# EAGLE design RTI-Dome-eth (EAGLE 7.7.0)

## Sheet 1 of 2
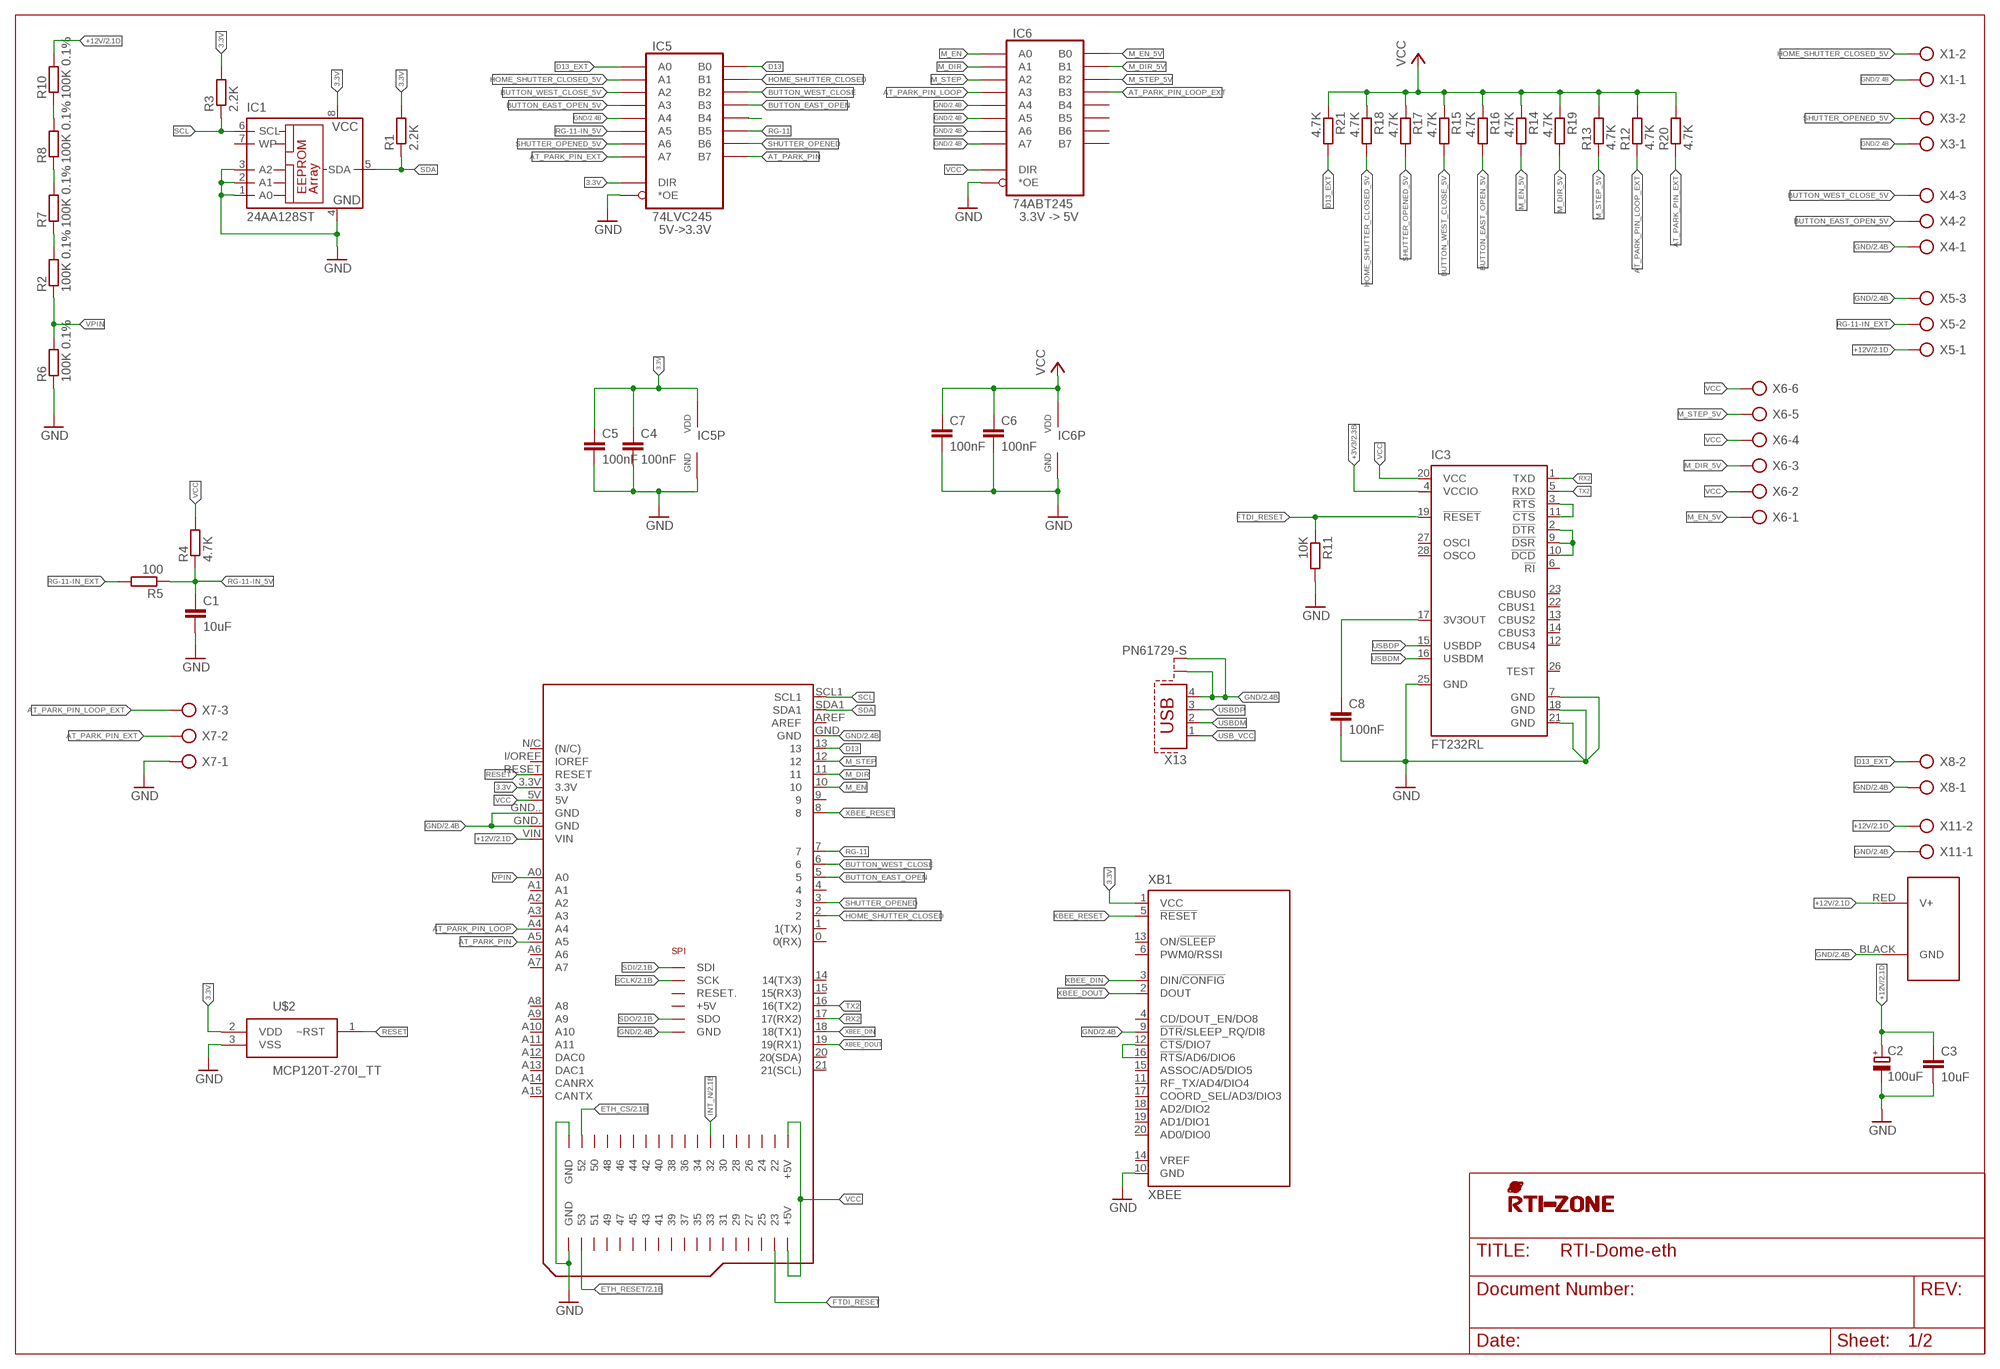
[diagram p0: schematic, sheet 1]

### Parts
C1  10uF  C-EU'0805'  [C0805]
C2  100uF  CPOL-EU  [UD-10X10_NICHICON]
C3  10uF  C-EU'0805'  [C0805]
C4  100nF  C-EU'0805'  [C0805]
C5  100nF  C-EU'0805'  [C0805]
C6  100nF  C-EU'0805'  [C0805]
C7  100nF  C-EU'0805'  [C0805]
C8  100nF  C-EU'0805'  [C0805]
IC1  24AA128ST  [TSSOP8]
IC3  FT232RL  [SSOP28]
IC5  74LVC245  [TSSOP20]
IC6  74ABT245  [TSSOP20]
J1  POWERPOLE_POWER45A  [POWERPOLE_PAIR_45A]
R1  2.2K  R-EU'0805'  [R0805]
R2  100K 0.1%  R-EU'0805'  [R0805]
R3  2.2K  R-EU'0805'  [R0805]
R4  4.7K  R-EU'0805'  [R0805]
R5  100  R-EU'0805'  [R0805]
R6  100K 0.1%  R-EU'0805'  [R0805]
R7  100K 0.1%  R-EU'0805'  [R0805]
R8  100K 0.1%  R-EU'0805'  [R0805]
R10  100K 0.1%  R-EU'0805'  [R0805]
R11  10K  R-EU'0805'  [R0805]
R12  4.7K  R-EU'0805'  [R0805]
R13  4.7K  R-EU'0805'  [R0805]
R14  4.7K  R-EU'0805'  [R0805]
R15  4.7K  R-EU'0805'  [R0805]
R16  4.7K  R-EU'0805'  [R0805]
R17  4.7K  R-EU'0805'  [R0805]
R18  4.7K  R-EU'0805'  [R0805]
R19  4.7K  R-EU'0805'  [R0805]
R20  4.7K  R-EU'0805'  [R0805]
R21  4.7K  R-EU'0805'  [R0805]
U$1  ARDUINO_DUE_SHIELD_FULL  [ARDUINO_DUE_SHIELD_FULL]
U$2  MCP120T-270I_TT  [SOT95P237X112-3N]
U$4  RTI-LOGO_BIG  [LOGO_BIG]
X1  AK500/2  [AK500/2]
X3  AK500/2  [AK500/2]
X4  AK500/3  [AK500/3]
X5  AK500/3  [AK500/3]
X6  AK500/6  [AK500/6]
X7  AK500/3  [AK500/3]
X8  AK500/2  [AK500/2]
X11  AK500/2  [AK500/2]
X13  PN61729-S  [PN61729-S]
XB1  XBEE  [XBEE]

### Nets
3.3V: C4.1 C5.1 IC1.8(VCC) IC5.P$1(DIR) IC5.P$20(VDD) R1.2 R3.2 U$1.3.3V U$2.2(VDD) XB1.1(VCC)
+3V3 [+3V3]: IC3.4(VCCIO) ; also sheet 2
+12V [+12V]: C2.+ C3.1 J1.RED(V+) R10.2 U$1.VIN X5.1 X11.2 ; also sheet 2
AT_PARK_PIN: IC5.P$11(B7) U$1.A5
AT_PARK_PIN_EXT: IC5.P$9(A7) R20.1 X7.2
AT_PARK_PIN_LOOP: IC6.P$5(A3) U$1.A4
AT_PARK_PIN_LOOP_EXT: IC6.P$15(B3) R12.1 X7.3
BUTTON_EAST_OPEN: IC5.P$15(B3) U$1.5
BUTTON_EAST_OPEN_5V: IC5.P$5(A3) R16.2 X4.2
BUTTON_WEST_CLOSE: IC5.P$16(B2) U$1.6
BUTTON_WEST_CLOSE_5V: IC5.P$4(A2) R15.2 X4.3
D13: IC5.P$18(B0) U$1.13
D13_EXT: IC5.P$2(A0) R21.2 X8.2
DTR_DSR_DCD: IC3.2(!DTR) IC3.9(!DSR) IC3.10(!DCD)
ETH_CS: U$1.52 ; also sheet 2
ETH_RESET: U$1.53 ; also sheet 2
FTDI_RESET: IC3.19(!RESET) R11.1 U$1.23
GND [GND]: C1.2 C2.- C3.2 C4.2 C5.2 C6.2 C7.2 C8.2 IC1.1(A0) IC1.2(A1) IC1.3(A2) IC1.4(GND) IC3.7(GND) IC3.18(GND) IC3.21(GND) IC3.25(GND) IC5.P$6(A4) IC5.P$10(GND) IC5.P$19(*OE) IC6.P$6(A4) IC6.P$7(A5) IC6.P$8(A6) IC6.P$9(A7) IC6.P$10(GND) IC6.P$19(*OE) J1.BLACK(GND) R6.1 R11.2 U$1.GND U$1.GND.(GND) U$1.GND..(GND) U$1.GND...(GND) U$1.GND....(GND) U$1.GND__(GND) U$2.3(VSS) X1.1 X3.1 X4.1 X5.3 X7.1 X8.1 X11.1 X13.4 X13.S1 X13.S2 XB1.9(!DTR!/SLEEP_RQ/DI8) XB1.10(GND) ; also sheet 2
HOME_SHUTTER_CLOSED: IC5.P$17(B1) U$1.2
HOME_SHUTTER_CLOSED_5V: IC5.P$3(A1) R18.2 X1.2
INT_N: U$1.32 ; also sheet 2
M_DIR: IC6.P$3(A1) U$1.11
M_DIR_5V: IC6.P$17(B1) R19.2 X6.3
M_EN: IC6.P$2(A0) U$1.10
M_EN_5V: IC6.P$18(B0) R14.2 X6.1
M_STEP: IC6.P$4(A2) U$1.12
M_STEP_5V: IC6.P$16(B2) R13.1 X6.5
N$2: R7.2 R8.1
N$3: R8.2 R10.1
N$4: IC5.P$14(B4)
N$5: R2.2 R7.1
N$6: C8.1 IC3.17(3V3OUT)
N$9: XB1.12(!CTS!/DIO7) XB1.16(!RTS!/AD6/DIO6)
RESET: U$1.RESET U$2.1(~RST)
RG-11: IC5.P$13(B5) U$1.7
RG-11-IN_5V: C1.1 IC5.P$7(A5) R4.1 R5.1
RG-11-IN_EXT: R5.2 X5.2
RTS_CTS: IC3.3(!RTS) IC3.11(!CTS)
RX2: IC3.1(TXD) U$1.17(17(RX2))
SCL: IC1.6(SCL) R3.1 U$1.SCL1
SCLK: U$1.SCK ; also sheet 2
SDA: IC1.5(SDA) R1.1 U$1.SDA1
SDI: U$1.MISO(SDI) ; also sheet 2
SDO: U$1.MOSI(SDO) ; also sheet 2
SHUTTER_OPENED: IC5.P$12(B6) U$1.3
SHUTTER_OPENED_5V: IC5.P$8(A6) R17.2 X3.2
TX2: IC3.5(RXD) U$1.16(16(TX2))
USB_VCC: X13.1
USBDM: IC3.16(USBDM) X13.2
USBDP: IC3.15(USBDP) X13.3
VCC: C6.1 C7.1 IC3.20(VCC) IC6.P$1(DIR) IC6.P$20(VDD) R4.2 R12.2 R13.2 R14.1 R15.1 R16.1 R17.1 R18.1 R19.1 R20.2 R21.1 U$1.5V U$1.5V.(+5V) U$1.5V..(+5V) X6.2 X6.4 X6.6
VPIN: R2.1 R6.2 U$1.A0
XBEE_DIN: U$1.18(18(TX1)) XB1.3(DIN/!CONFIG)
XBEE_DOUT: U$1.19(19(RX1)) XB1.2(DOUT)
XBEE_RESET: U$1.8 XB1.5(!RESET)
Unconnected: IC1.7(WP) IC3.6(!RI) IC3.12(CBUS4) IC3.13(CBUS2) IC3.14(CBUS3) IC3.22(CBUS1) IC3.23(CBUS0) IC3.26(TEST) IC3.27(OSCI) IC3.28(OSCO) IC6.P$11(B7) IC6.P$12(B6) IC6.P$13(B5) IC6.P$14(B4) U$1.0(0(RX)) U$1.1(1(TX)) U$1.4 U$1.9 U$1.14(14(TX3)) U$1.15(15(RX3)) U$1.20(20(SDA)) U$1.21(21(SCL)) U$1.22 U$1.24 U$1.25 U$1.26 U$1.27 U$1.28 U$1.29 U$1.30 U$1.31 U$1.33 U$1.34 U$1.35 U$1.36 U$1.37 U$1.38 U$1.39 U$1.40 U$1.41 U$1.42 U$1.43 U$1.44 U$1.45 U$1.46 U$1.47 U$1.48 U$1.49 U$1.50 U$1.51 U$1.A1 U$1.A2 U$1.A3 U$1.A6 U$1.A7 U$1.A8 U$1.A9 U$1.A10 U$1.A11 U$1.A12(DAC0) U$1.A13(DAC1) U$1.A14(CANRX) U$1.A15(CANTX) U$1.AREF U$1.I/OREF(IOREF) U$1.N/C((N/C)) U$1.RESET. XB1.4(CD/DOUT_EN/DO8) XB1.6(PWM0/RSSI) XB1.11(RF_TX/AD4/DIO4) XB1.13(ON/!SLEEP) XB1.14(VREF) XB1.15(ASSOC/AD5/DIO5) XB1.17(COORD_SEL/AD3/DIO3) XB1.18(AD2/DIO2) XB1.19(AD1/DIO1) XB1.20(AD0/DIO0)

### Notes on the sheet
- 3.3V -> 5V
- 5V->3.3V

## Sheet 2 of 2
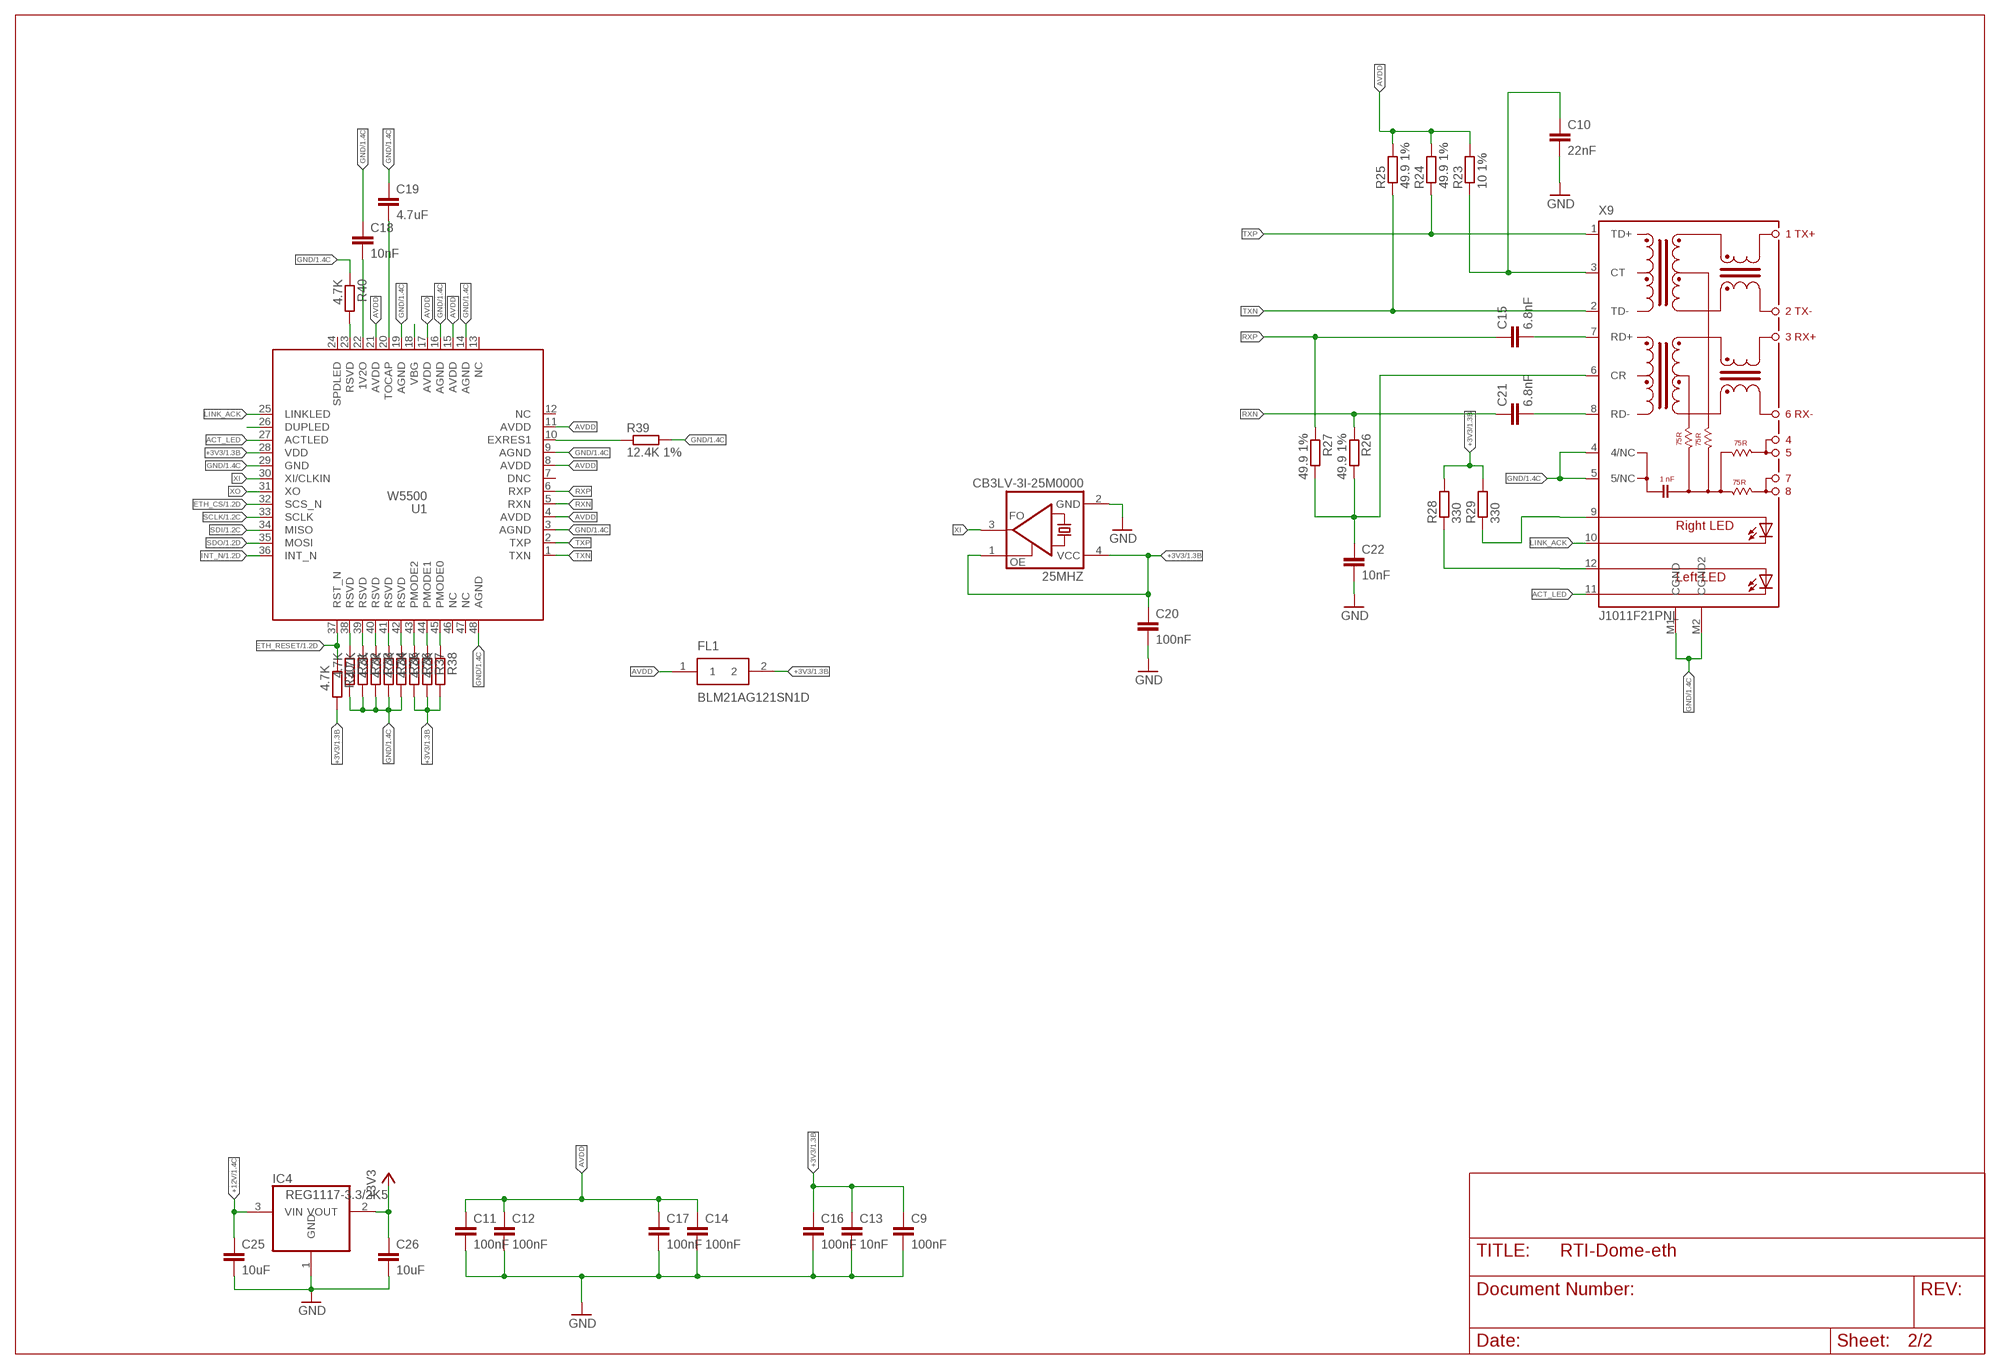
[diagram p1: schematic, sheet 2]

### Parts
25MHZ  CB3LV-3I-25M0000  CB3LV-OSCILATOR  [SMD-7050_4P]
C9  100nF  C-EU'0805'  [C0805]
C10  22nF  C-EU'0805'  [C0805]
C11  100nF  C-EU'0805'  [C0805]
C12  100nF  C-EU'0805'  [C0805]
C13  10nF  C-EU'0805'  [C0805]
C14  100nF  C-EU'0805'  [C0805]
C15  6.8nF  C-EU'0805'  [C0805]
C16  100nF  C-EU'0805'  [C0805]
C17  100nF  C-EU'0805'  [C0805]
C18  10nF  C-EU'0805'  [C0805]
C19  4.7uF  C-EU'0805'  [C0805]
C20  100nF  C-EU'0805'  [C0805]
C21  6.8nF  C-EU'0805'  [C0805]
C22  10nF  C-EU'0805'  [C0805]
C25  10uF  C-EU'0805'  [C0805]
C26  10uF  C-EU'0805'  [C0805]
FL1  BLM21AG121SN1D  [L0805]
IC4  REG1117-3.3/2K5  REG1117  [SOT223]
R23  10 1%  R-EU'0805'  [R0805]
R24  49.9 1%  R-EU'0805'  [R0805]
R25  49.9 1%  R-EU'0805'  [R0805]
R26  49.9 1%  R-EU'0805'  [R0805]
R27  49.9 1%  R-EU'0805'  [R0805]
R28  330  R-EU'0805'  [R0805]
R29  330  R-EU'0805'  [R0805]
R30  4.7K  R-EU'0805'  [R0805]
R31  4.7K  R-EU'0805'  [R0805]
R32  4.7K  R-EU'0805'  [R0805]
R33  4.7K  R-EU'0805'  [R0805]
R34  4.7K  R-EU'0805'  [R0805]
R35  4.7K  R-EU'0805'  [R0805]
R36  4.7K  R-EU'0805'  [R0805]
R37  4.7K  R-EU'0805'  [R0805]
R38  4.7K  R-EU'0805'  [R0805]
R39  12.4K 1%  R-EU'0805'  [R0805]
R40  4.7K  R-EU'0805'  [R0805]
U1  W5500  [LQFP48]
X9  J1011F21PNL  [J1011F21PNL]

### Nets
+3V3 [+3V3]: 25MHZ.1(OE) 25MHZ.4(VDD) C9.1 C13.1 C16.1 C20.1 C26.1 FL1.2 IC4.2(VOUT) R28.2 R29.2 R30.2 R36.2 R37.2 R38.2 U1.28(VDD) ; also sheet 1
+12V [+12V]: C25.1 IC4.3(VIN) ; also sheet 1
ACT_LED: U1.27(ACTLED) X9.11(C-L)
AVDD: C11.1 C12.1 C14.1 C17.1 FL1.1 R23.2 R24.2 R25.2 U1.4(AVDD) U1.8(AVDD) U1.11(AVDD) U1.15(AVDD) U1.17(AVDD) U1.21(AVDD)
ETH_CS: U1.32(SCS_N) ; also sheet 1
ETH_RESET: R30.1 U1.37(RST_N) ; also sheet 1
GND [GND]: 25MHZ.2(GND) C9.2 C10.2 C11.2 C12.2 C13.2 C14.2 C16.2 C17.2 C18.1 C19.1 C20.2 C22.2 C25.2 C26.2 IC4.1(GND) R31.2 R32.2 R33.2 R34.2 R35.2 R39.2 R40.1 U1.3(AGND) U1.9(AGND) U1.14(AGND) U1.16(AGND) U1.19(AGND) U1.29(GND) U1.48(AGND) X9.4(4/NC) X9.5(5/NC) X9.M1(CGND) X9.M2(CGND2) ; also sheet 1
INT_N: U1.36(INT_N) ; also sheet 1
LINK_ACK: U1.25(LINKLED) X9.10(C-R)
N$7 [+3V3]: C22.1 R26.2 R27.2 X9.6(CR)
N$8: R29.1 X9.9(A-R)
N$10: R28.1 X9.12(AL)
N$11: C15.2 X9.7(RD+)
N$12: C21.2 X9.8(RD-)
N$13 [+3V3]: C10.1 R23.1 X9.3(CT)
N$17: U1.26(DUPLED)
N$22: R31.1 U1.38(RSVD)
N$23: R32.1 U1.39(RSVD)
N$24: R33.1 U1.40(RSVD)
N$25: R34.1 U1.41(RSVD)
N$26: R35.1 U1.42(RSVD)
N$27: R36.1 U1.43(PMODE2)
N$28: R37.1 U1.44(PMODE1)
N$29: R38.1 U1.45(PMODE0)
N$31: C19.2 U1.20(TOCAP)
N$32: U1.18(VBG)
N$33: C18.2 U1.22(1V2O)
N$34: R39.1 U1.10(EXRES1)
N$35: R40.2 U1.23(RSVD)
RXN: C21.1 R26.1 U1.5(RXN)
RXP: C15.1 R27.1 U1.6(RXP)
SCLK: U1.33(SCLK) ; also sheet 1
SDI: U1.34(MISO) ; also sheet 1
SDO: U1.35(MOSI) ; also sheet 1
TXN [diff]: R25.1 U1.1(TXN) X9.2(TD-)
TXP: R24.1 U1.2(TXP) X9.1(TD+)
XI: 25MHZ.3(FO) U1.30(XI/CLKIN)
XO: U1.31(XO)
Unconnected: U1.7(DNC) U1.12(NC) U1.13(NC) U1.24(SPDLED) U1.46(NC) U1.47(NC)

## Power pins joined to a net without a drawn wire
+5V: U$1.+5V_(+5V)

## Library data of the parts
25MHZ = rti:CB3LV-OSCILATOR; MPN: CB3LV-3I-25M0000
C1 C3 C25 C26 = rti:C-EU; MPN: CC0805KKX5R8BB106
C2 = rti:CPOL-EU; MPN: MAL215099804E3
C4-C9 C11 C12 C14 C16 C17 C20 = rti:C-EU; MPN: 0805YD104KAT2A
C10 = rti:C-EU; MPN: CC0805JRX7R8BB223
C13 C18 C22 = rti:C-EU; MPN: CC0805KRX7R9BB103
C15 C21 = rti:C-EU; MPN: C0805C682F4HACTU
C19 = rti:C-EU; MPN: C0805C475J3RACTU
FL1 = BLM21AG121SN1D:BLM21AG121SN1D: BLM21_N1D Series EMI Suppression Filter 120+/-25% at 100MHz 1A @85 Source: Datasheet <https://www.murata.com/en-us/products/productdetail?partno=BLM21AG121SN1#>; MPN: BLM21AG121SN1D
IC1 = microchip:24*: Serial EEPROM I2C; MF: MICROCHIP; MPN: 24AA128-I/ST; OC_FARNELL: unknown; OC_NEWARK: 92C6843
IC3 = ftdichip:FT232R: Source: http://www.ftdichip.com/Documents/DataSheets/DS_FT232R_v104.pdf; MPN: FT232RL-REEL; OC_FARNELL: 1146032; OC_NEWARK: 91K9918
IC4 = burr-brown:REG1117: 800mA and 1A Low Dropout (LDO) Positive Regulator 1.8V, 2.5V, 2.85V, 3.3V, 5V, and Adj; MPN: REG1117-3.3/2K5; OC_FARNELL: 1097566; OC_NEWARK: 14P6981
IC5 = rti:74*245; MPN: 74LVC245APW,112
IC6 = rti:74*245; MPN: 74ABT245PW,112
J1 = powerpoles:POWERPOLE_POWER: Anderson Powerpole Power Connector using ameteur radio standard layout
R1 R3 = rti:R-EU; MPN: RT0805FRE071KL
R2 R6-R8 R10 = rti:R-EU; MPN: AT0805BRD07100KL
R4 R12-R21 R30-R38 R40 = rti:R-EU; MPN: RT0805FRE074K7L
R5 = rti:R-EU; MPN: RT0805FRD07100RL
R11 = rti:R-EU; MPN: RT0805FRE0710KL
R23 = rti:R-EU; MPN: RT0805FRE1310RL
R24-R27 = rti:R-EU; MPN: RC0805FR-0749R9L
R28 R29 = rti:R-EU; MPN: RC0805JR-07330RL
R39 = rti:R-EU; MPN: RC0805FR-0712K4L
U1 = W5500:W5500; MPN: W5500
U$1 = arduino_shield:ARDUINO_DUE_SHIELD_FULL
U$2 = MCP120T-270I_TT:MCP120T-270I_TT: Microcontroller Supervisory Circuit Source: Datasheet; DESCRIPTION: Microcontroller Supervisory Circuit; HEIGHT: mm; MANUFACTURER_NAME: Microchip; MANUFACTURER_PART_NUMBER: MCP120T-270I/TT; MOUSER_PART_NUMBER: 579-MCP120T-270I/TT; MOUSER_PRICE-STOCK: https://www.mouser.co.uk/ProductDetail/Microchip-Technology/MCP120T-270I-TT?qs=JaP0%252BruNJH91Pwyk6aJdSA%3D%3D; MPN: MCP120T-270I/TT
U$4 = rti:RTI-LOGO
X1 X3 X8 X11 = con-ptr500:AK500/2: CONNECTOR; MPN: 691101710002; OC_FARNELL: unknown; OC_NEWARK: unknown
X4 X5 X7 = con-ptr500:AK500/3: CONNECTOR; MPN: 691101710003; OC_FARNELL: unknown; OC_NEWARK: unknown
X6 = con-ptr500:AK500/6: CONNECTOR; MPN: 30.706; OC_FARNELL: unknown; OC_NEWARK: unknown
X9 = rti:J1011F: PULSEJACK (TM) 1x1 Tab-UP RJ45 10/100 Base-TX RJ45 1x1 Tab-UP with LEDs 8-pin (J1 series) and 6-pin (JP series) integrated magnetics connector, designed to support applications, such as ADSL modems, LAN-on-Motherboard, and Hub and Switches. Source: www.pulseeng.com .. PulseJack-J402.pdf; MPN: J1011F21PNL
X13 = con-berg:PN61729-S: BERG USB connector; MPN: SS-52300-001; OC_FARNELL: unknown; OC_NEWARK: unknown
XB1 = maxstream:XBEE: XBee (TM) /XBee-PRO(TM) OEM RF Modules Source: MaxStream, Inc. xbee_productmanual.pdf; MPN: XBP24-Z7UIT-004; OC_FARNELL: 1751799; OC_NEWARK: 34R5507

## Net classes
0 default: width 0.254 mm, drill 0.3 mm, clearance 0.152 mm
1 +12V: width 0.254 mm, drill 0.3 mm, clearance 0.152 mm
2 GND: width 0.254 mm, drill 0.3 mm, clearance 0.152 mm
3 +3V3: width 0.254 mm, drill 0.254 mm, clearance 0.152 mm
4 diff: width 0.254 mm, drill 0.254 mm, clearance 0.152 mm

## Board
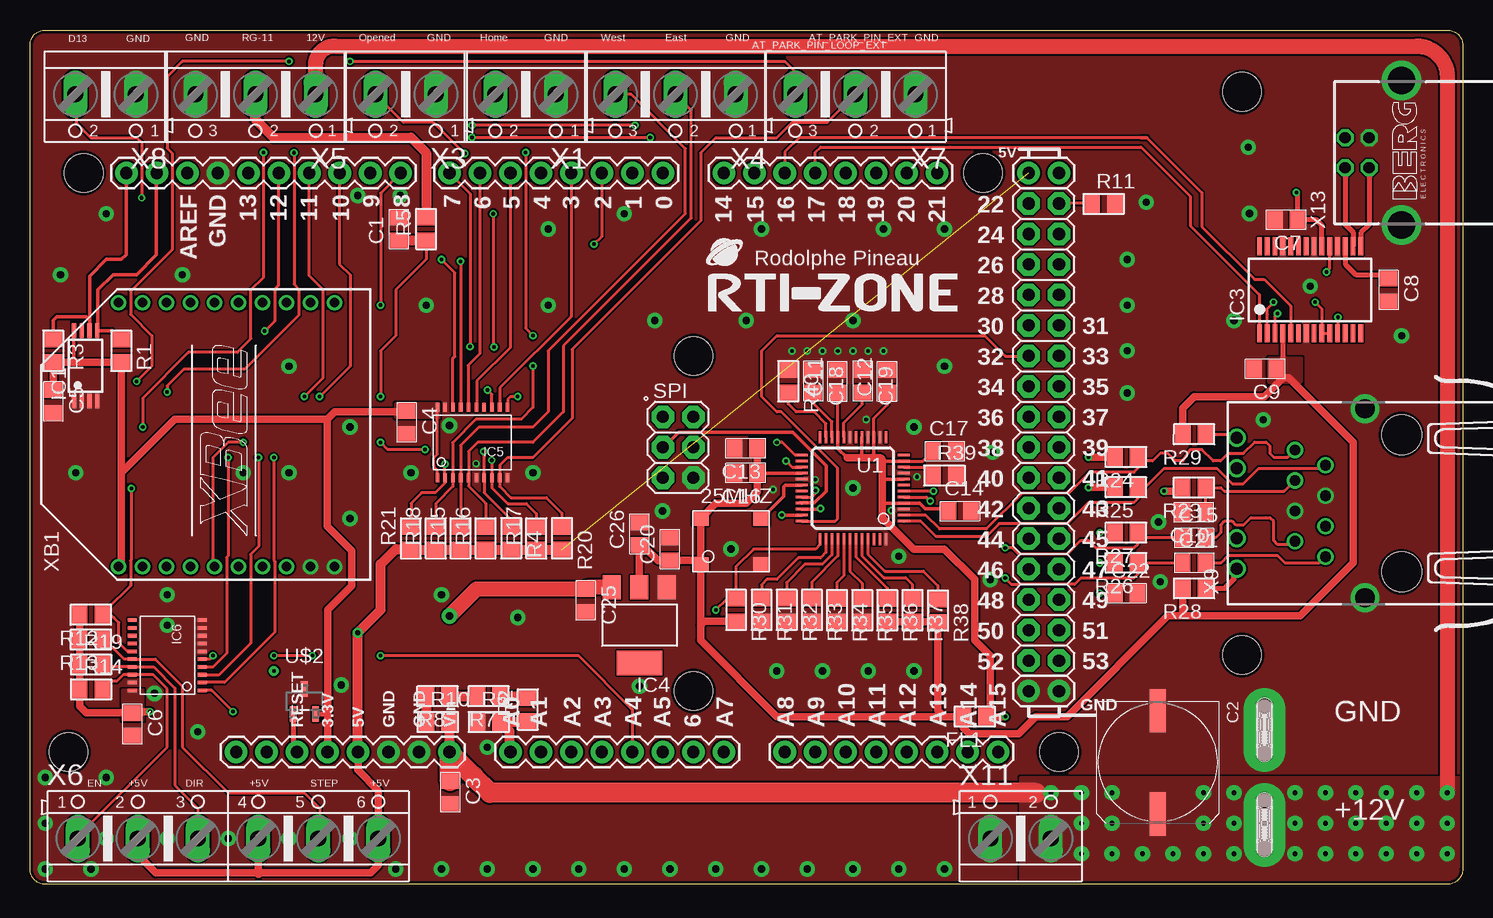
[diagram p2: board, top side]
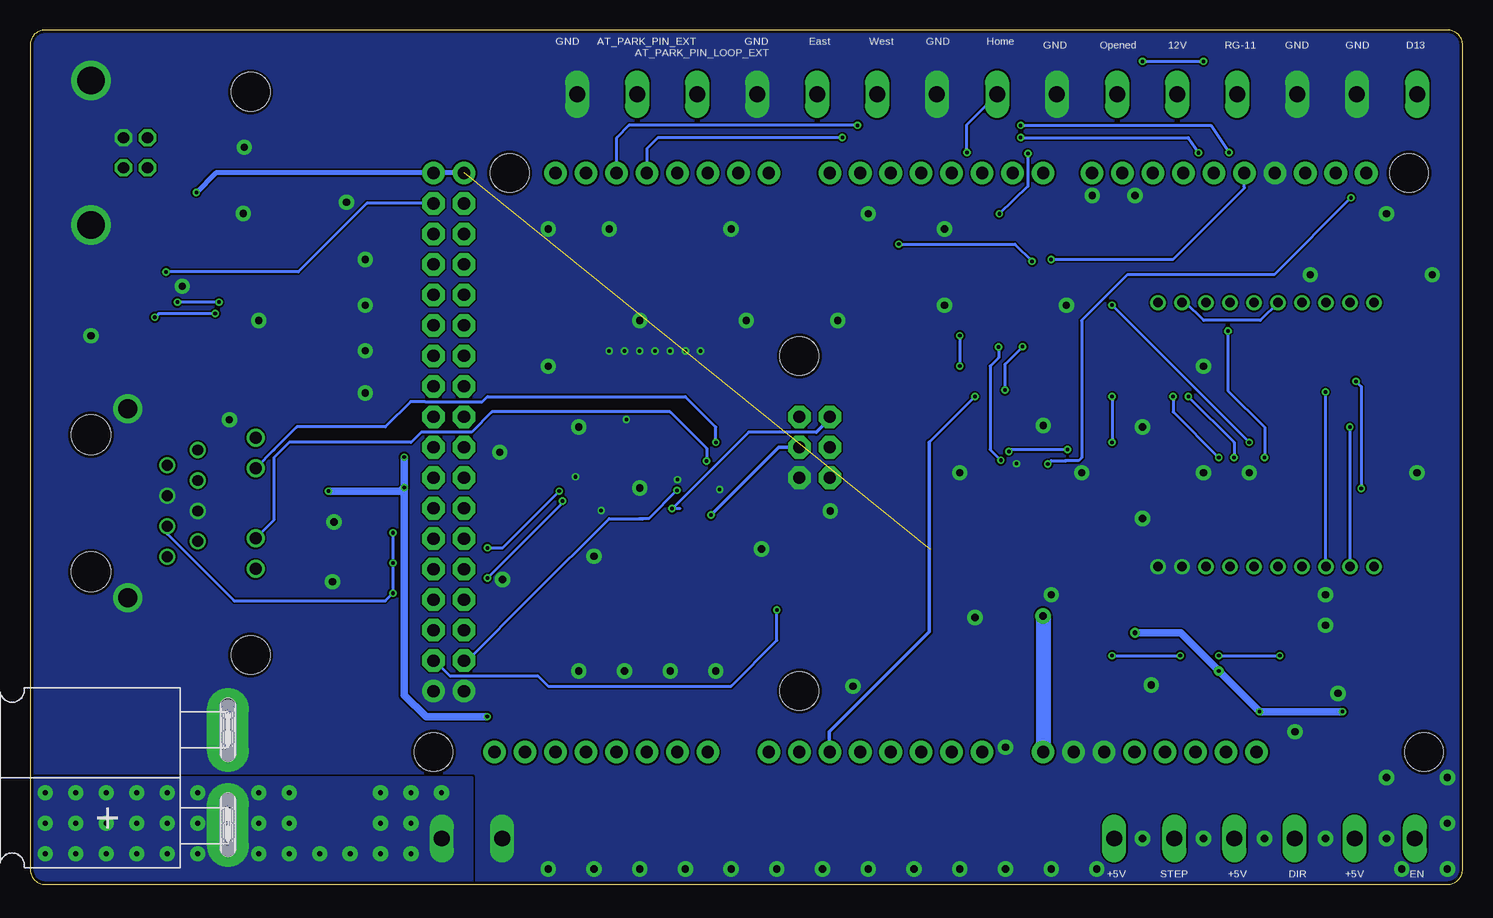
[diagram p3: board, bottom side, seen from below]

Size 119.39 x 71.19 mm. Coordinates in mm from the lower left corner, seen from the top.
Outline: 0,69.93 arc-90 1.26,71.19 118.12,71.19 arc-90 119.39,69.93 119.39,1.26 arc-90 118.12,0 1.26,0 arc-90 0,1.26 0,69.93
Copper layers (1*16): Top 0.35mm / dielectric 1.6mm / Bottom 0.35mm
Design rules "jlcpcb2layer *": minimum track width 5mil, minimum drill 0.2mm, track to track 5mil, track to pad 5mil, pad to pad 5mil, via to via 5mil, smd to smd 5mil, copper to edge 10mil, drill to drill 0.5mm, minimum pad ring 6mil, minimum via ring 6mil, stop-mask expansion 0.05mm, vias tented up to drill 130mil, thermal gap 8mil
Holes 3.2 mm at 100.99,66.04 100.99,19.11

### Footprints (pad centres in the part's own frame; a part is rotated, then mirrored left to right if it is on the bottom)
SMD-7050_4P = smd 1.397 x 1.194: 1 -2.54,-1.27; 2 2.54,-1.27; 3 2.54,2.54; 4 -2.54,2.54
C0805 = smd 1.3 x 1.5: 1 -0.95,0; 2 0.95,0
UD-10X10_NICHICON = smd 3.6 x 1.3: + 4.3,0; - -4.3,0
L0805 = smd 1.3 x 1.5: 1 -0.95,0; 2 0.95,0
TSSOP8 = smd 0.35 x 1.2: 1 -0.975,-2.925; 2 -0.325,-2.925; 3 0.325,-2.925; 4 0.975,-2.925; 5 0.975,2.925; 6 0.325,2.925; 7 -0.325,2.925; 8 -0.975,2.925
SSOP28 = smd 0.4 x 1.5: 1 -4.225,-3.625; 2 -3.575,-3.625; 3 -2.925,-3.625; 4 -2.275,-3.625; 5 -1.625,-3.625; 6 -0.975,-3.625; 7 -0.325,-3.625; 8 0.325,-3.625; 9 0.975,-3.625; 10 1.625,-3.625; 11 2.275,-3.625; 12 2.925,-3.625; 13 3.575,-3.625; 14 4.225,-3.625; 15 4.225,3.625; 16 3.575,3.625; 17 2.925,3.625; 18 2.275,3.625; 19 1.625,3.625; 20 0.975,3.625; 21 0.325,3.625; 22 -0.325,3.625; 23 -0.975,3.625; 24 -1.625,3.625; 25 -2.275,3.625; 26 -2.925,3.625; 27 -3.575,3.625; 28 -4.225,3.625
SOT223 = smd 1.499 x 2.007: 1 -2.261,-3.15; 2 0.025,-3.15; 3 2.311,-3.15 | smd 3.81 x 2.007: 4 0,3.15
TSSOP20 = smd 0.75 x 0.3: P$1 -2.94,2.885; P$2 -2.94,2.235; P$3 -2.94,1.585; P$4 -2.94,0.935; P$5 -2.94,0.285; P$6 -2.94,-0.365; P$7 -2.94,-1.015; P$8 -2.94,-1.665; P$9 -2.94,-2.315; P$10 -2.94,-2.965; P$11 2.91,-2.965; P$12 2.91,-2.315; P$13 2.91,-1.665; P$14 2.91,-1.015; P$15 2.91,-0.365; P$16 2.91,0.285; P$17 2.91,0.935; P$18 2.91,1.585; P$19 2.91,2.235; P$20 2.91,2.885
POWERPOLE_PAIR_45A = drill 1.27 pad 3.5 long: BLACK 3.97,0.02; RED -3.93,0.02 | hole 1.27: -1.95,0.02; -5.91,0.02; 1.99,0.02; 5.95,0.02; -4.64,0.02; -3.37,0.02; 3.26,0.02; 4.68,0.02; -5.656,0.02; -5.783,0.02; -5.529,0.02; -5.402,0.02; -5.275,0.02; -5.148,0.02; -5.021,0.02; -4.894,0.02; -4.767,0.02; -2.077,0.02; -2.204,0.02; -2.331,0.02; -2.458,0.02; -2.585,0.02; -2.712,0.02; -2.966,0.02; -2.839,0.02; -3.093,0.02; -3.22,0.02; -3.497,0.02; -3.624,0.02; -3.751,0.02; -3.878,0.02; -4.005,0.02; -4.132,0.02; -4.259,0.02; -4.386,0.02; -4.513,0.02; 5.823,0.02; 5.696,0.02; 5.569,0.02; 5.442,0.02; 5.315,0.02; 5.188,0.02; 5.061,0.02; 4.934,0.02; 4.807,0.02; 4.553,0.02; 4.426,0.02; 4.299,0.02; 4.045,0.02; 4.045,0.02; 4.172,0.02; 3.918,0.02; 3.791,0.02; 3.791,0.02; 3.664,0.02; 3.664,0.02; 3.664,0.02; 3.537,0.02; 3.537,0.02; 3.41,0.02; 3.133,0.02; 3.006,0.02; 2.879,0.02; 2.752,0.02; 2.625,0.02; 2.498,0.02; 2.371,0.02; 2.244,0.02; 2.117,0.02
R0805 = smd 1.3 x 1.5: 1 -0.95,0; 2 0.95,0
LQFP48 = smd 1 x 0.2: 1 -4.25,2.75; 2 -4.25,2.25; 3 -4.25,1.75; 4 -4.25,1.25; 5 -4.25,0.75; 6 -4.25,0.25; 7 -4.25,-0.25; 8 -4.25,-0.75; 9 -4.25,-1.25; 10 -4.25,-1.75; 11 -4.25,-2.25; 12 -4.25,-2.75; 25 4.25,-2.75; 26 4.25,-2.25; 27 4.25,-1.75; 28 4.25,-1.25; 29 4.25,-0.75; 30 4.25,-0.25; 31 4.25,0.25; 32 4.25,0.75; 33 4.25,1.25; 34 4.25,1.75; 35 4.25,2.25; 36 4.25,2.75 | smd 0.2 x 1: 13 -2.75,-4.25; 14 -2.25,-4.25; 15 -1.75,-4.25; 16 -1.25,-4.25; 17 -0.75,-4.25; 18 -0.25,-4.25; 19 0.25,-4.25; 20 0.75,-4.25; 21 1.25,-4.25; 22 1.75,-4.25; 23 2.25,-4.25; 24 2.75,-4.25; 37 2.75,4.25; 38 2.25,4.25; 39 1.75,4.25; 40 1.25,4.25; 41 0.75,4.25; 42 0.25,4.25; 43 -0.25,4.25; 44 -0.75,4.25; 45 -1.25,4.25; 46 -1.75,4.25; 47 -2.25,4.25; 48 -2.75,4.25
ARDUINO_DUE_SHIELD_FULL = drill 1.016 pad 1.88: 0 13.97,24.13; 1 11.43,24.13; 2 8.89,24.13; 3 6.35,24.13; 3.3V -13.97,-24.13; 4 3.81,24.13; 5 1.27,24.13; 5V -11.43,-24.13; 5V. 44.45,24.13; 5V.. 46.99,24.13; 6 -1.27,24.13; 7 -3.81,24.13; 8 -7.874,24.13; 9 -10.414,24.13; 10 -12.954,24.13; 11 -15.494,24.13; 12 -18.034,24.13; 13 -20.574,24.13; 14 19.05,24.13; 15 21.59,24.13; 16 24.13,24.13; 17 26.67,24.13; 18 29.21,24.13; 19 31.75,24.13; 20 34.29,24.13; 21 36.83,24.13; A0 1.27,-24.13; A1 3.81,-24.13; A2 6.35,-24.13; A3 8.89,-24.13; A4 11.43,-24.13; A5 13.97,-24.13; A6 16.51,-24.13; A7 19.05,-24.13; A8 24.13,-24.13; A9 26.67,-24.13; A10 29.21,-24.13; A11 31.75,-24.13; A12 34.29,-24.13; A13 36.83,-24.13; A14 39.37,-24.13; A15 41.91,-24.13; AREF -25.654,24.13; GND -23.114,24.13; GND. -6.35,-24.13; GND.. -8.89,-24.13; GND... 44.45,-19.05; GND.... 46.99,-19.05; I/OREF -19.05,-24.13; N/C -21.59,-24.13; RESET -16.51,-24.13; SCL1 -30.734,24.13; SDA1 -28.194,24.13; VIN -3.81,-24.13 | drill 1.016 pad 1.88 octagon: 22 44.45,21.59; 23 46.99,21.59; 24 44.45,19.05; 25 46.99,19.05; 26 44.45,16.51; 27 46.99,16.51; 28 44.45,13.97; 29 46.99,13.97; 30 44.45,11.43; 31 46.99,11.43; 32 44.45,8.89; 33 46.99,8.89; 34 44.45,6.35; 35 46.99,6.35; 36 44.45,3.81; 37 46.99,3.81; 38 44.45,1.27; 39 46.99,1.27; 40 44.45,-1.27; 41 46.99,-1.27; 42 44.45,-3.81; 43 46.99,-3.81; 44 44.45,-6.35; 45 46.99,-6.35; 46 44.45,-8.89; 47 46.99,-8.89; 48 44.45,-11.43; 49 46.99,-11.43; 50 44.45,-13.97; 51 46.99,-13.97; 52 44.45,-16.51; 53 46.99,-16.51; +5V_ 16.51,3.81; GND__ 16.51,-1.27; MISO 13.97,3.81; MOSI 16.51,1.27; RESET. 13.97,-1.27; SCK 13.97,1.27 | hole 3.2: -34.29,24.13; -35.56,-24.13; 16.51,8.89; 16.51,-19.05; 40.64,24.13; 46.99,-24.13
SOT95P237X112-3N = smd 0.559 x 1.27: 1 -0.94,-1.041; 2 0.94,-1.041; 3 0,1.041
AK500/2 = drill 1.321 long: 1 -2.515,0; 2 2.515,0
AK500/3 = drill 1.321 long: 1 -5.004,0; 2 0,0; 3 5.004,0
AK500/6 = drill 1.321 long: 1 -12.522,0; 2 -7.518,0; 3 -2.515,0; 4 2.515,0; 5 7.518,0; 6 12.522,0
J1011F21PNL = drill 0.9 pad 1.3: 1 4.445,2.54; 2 3.175,0; 3 1.905,2.54; 4 0.635,0; 5 -0.635,2.54; 6 -1.905,0; 7 -3.175,2.54; 8 -4.445,0 | drill 1 pad 1.422: 9 5.465,7.37; 10 2.925,7.37; 11 -2.925,7.37; 12 -5.465,7.37 | drill 1.6 pad 2.184: M1 -7.875,-3.3; M2 7.875,-3.3 | hole 3.3: 5.715,-6.35; -5.715,-6.35
PN61729-S = drill 0.95 octagon: 1 1.25,4.71; 2 -1.25,4.71; 3 -1.25,2.71; 4 1.25,2.71 | drill 2.3 pad 2.9: S1 -6.02,0; S2 6.02,0
XBEE = drill 0.8 pad 1.27: 1 -11,9; 2 -11,7; 3 -11,5; 4 -11,3; 5 -11,1; 6 -11,-1; 7 -11,-3; 8 -11,-5; 9 -11,-7; 10 -11,-9; 11 11,-9; 12 11,-7; 13 11,-5; 14 11,-3; 15 11,-1; 16 11,1; 17 11,3; 18 11,5; 19 11,7; 20 11,9

### Placement (x,y rotation side)
25MHZ  58.42,27.94 0 top
C1  30.73,54.61 90 top
C2  93.98,10.16 270 top
C3  34.99,7.65 270 top
C4  31.37,38.48 270 top
C5  1.94,40.23 270 top
C6  8.51,13.34 270 top
C7  104.68,55.37 180 top
C8  113.19,49.53 270 top
C9  102.93,42.96 180 top
C10  97,30.99 180 top
C11  67.31,41.91 90 top
C12  71.44,41.91 90 top
C13  59.66,36.32 180 top
C14  77.47,31.11 0 top
C15  97,28.88 0 top
C16  59.66,34.26 180 top
C17  76.2,36.11 0 top
C18  65.25,41.91 270 top
C19  69.37,41.91 270 top
C20  53.34,27.94 90 top
C21  97,26.8 0 top
C22  91.35,24.25 0 top
C25  46.3,23.66 270 top
C26  50.8,29.21 90 top
FL1  78.74,13.97 180 top
IC1  4.64,43.21 0 top
IC3  106.68,49.53 0 top
IC4  50.8,21.59 180 top
IC5  36.83,36.83 90 top
IC6  11.43,19.05 180 top
J1  102.87,8.89 90 bottom
R1  7.59,44.45 270 top
R2  41.5,14.57 90 top
R3  1.94,44.45 270 top
R4  40.1,28.83 270 top
R5  33.02,54.61 90 top
R6  38.23,13.53 0 top
R7  38.23,15.65 180 top
R8  33.97,15.65 180 top
R10  33.97,13.53 0 top
R11  89.46,56.7 0 top
R12  5.08,22.45 180 top
R13  5.08,20.38 180 top
R14  5.08,16.26 0 top
R15  35.88,28.83 90 top
R16  37.97,28.83 90 top
R17  42.2,28.83 90 top
R18  33.81,28.83 90 top
R19  5.08,18.32 0 top
R20  44.32,28.83 270 top
R21  31.75,28.83 90 top
R23  97,33.05 180 top
R24  91.35,35.59 180 top
R25  91.35,33.08 180 top
R26  91.35,26.77 180 top
R27  91.35,29.3 180 top
R28  97.03,24.65 180 top
R29  97.02,37.48 180 top
R30  58.83,22.86 270 top
R31  60.96,22.86 270 top
R32  63.06,22.86 270 top
R33  65.15,22.86 270 top
R34  67.25,22.83 270 top
R35  69.34,22.83 270 top
R36  71.44,22.83 270 top
R37  73.53,22.83 270 top
R38  75.66,22.8 270 top
R39  76.2,34.08 0 top
R40  63.18,41.91 270 top
U1  68.58,33.02 180 top
U$1  38.77,35.15 0 top
U$2  22.86,15.24 0 top
U$4  56.52,47.75 0 top
X1  41.3,65.83 180 top
X3  31.3,65.83 180 top
X4  53.79,65.83 180 top
X5  18.79,65.83 180 top
X6  16.51,3.81 0 top
X7  68.78,65.83 180 top
X8  6.3,65.83 180 top
X9  107.95,31.75 90 top
X11  82.55,3.81 0 top
X13  114.3,60.96 90 top
XB1  16.38,37.47 90 top

### Tracks (layer width: path | path; a pad name or v marks a point on that pad's centre or on a via)
3.3V
  Top 0.254: IC5.P$1 33.94,34.51 33.69,34.77 33.69,34.86 33.66,34.89 33.66,35.56 33.95,35.85 IC5.P$20
  Top 0.305: IC1.8 3.66,43.65 3.81,43.5
  Top 0.406: 31.43,39.49 C4.1 | U$2.2 24.57,14.2 24.8,13.97
  Top 0.61: 24.77,38.73 25.4,39.37 31.31,39.37 | 24.77,38.73 12.06,38.73 7.62,34.29 | 7.62,34.29 7.62,26.7 XB1.1 | 24.77,38.73 24.77,29.84 26.8,27.78 26.8,24.86 24.8,22.86 24.8,13.97 U$1.3.3V | 7.62,34.29 7.62,43.47 arc90 R1.2 3.81,43.5 R3.2 C5.1
  Top 0.813: 31.31,39.37 C4.1
  pour Top (isolate 0.254, no thermals): 30.48,40.07 34.07,40.07 34.07,38.86 30.48,38.86
+3V3
  Top 0.254: 55.56,26.99 25MHZ.1
  Top 0.305: C16.1 U1.28
  Top 0.406: IC3.4 104.41,43.45 104.14,43.18
  Top 0.61: C13.1 C16.1 | 55.56,26.99 C20.1 52.34,26.98 51.51,27.81 C26.1 50.77,27.79 IC4.2 | R29.2 96.08,39.69 97.02,40.64 102.87,40.64 104.14,41.91 104.44,42.21 104.89,42.21 110.25,36.85 110.25,26.77 105.84,22.36 96.08,22.36 | 55.88,21.59 25MHZ.1 25MHZ.4 57.15,31.75 59.68,31.75 60.61,32.68 C16.1 | 55.88,21.59 55.88,20.32 62.23,13.97 76.2,13.97 | R30.2 56.2,21.91 55.88,21.59 | R36.2 R37.2 75.63,21.88 R38.2 75.66,14.51 76.2,13.97 | 76.2,13.97 FL1.2 77.79,13.04 78.28,12.55 82.4,12.55 83.82,13.97 86.36,13.97 86.42,13.97 94.81,22.36 96.08,22.36 | R28.2 96.08,22.36
  pour Top (isolate 0.122, no thermals): 103.31,43.81 105.85,43.81 105.83,41.89 103.29,41.89
+12V  (via drill 0.4 pad 1.27, 0.6 pad 1.27)
  Top 0.813: R10.2 34.96,13.49 U$1.VIN
  Top 1.27: v118.11,7.62 118.11,67.31 arc90 115.57,69.85 25.4,69.85 arc90 23.8,68.35 X5.1 | IC4.3 46.44,24.74 C25.1 37.2,24.61 v34.97,22.36
  Top 1.676: 83.82,7.62 38.35,7.62 36.96,9.02 U$1.VIN 34.99,10.99 C3.1
  Bottom 1.27: v34.97,22.36 U$1.VIN
  other vias: 107.95,5.08 105.41,7.62 107.95,7.62 110.49,7.62 105.41,5.08 97.79,7.62 113.03,5.08 110.49,5.08 113.03,2.54 100.33,5.08 105.41,2.54 115.57,2.54 118.11,2.54 115.57,5.08 118.11,5.08 113.03,7.62 115.57,7.62 100.33,7.62 110.49,2.54 107.95,2.54 97.79,5.08 100.33,2.54 97.79,2.54 95.25,2.54 92.71,2.54 90.17,5.08 87.63,2.54 90.17,2.54 90.17,7.62 87.63,5.08 87.63,7.62 85.09,7.62
  pour Top (isolate 0.122, no thermals): 82.55,8.89 119.38,8.89 119.38,0 82.55,0
  pour Bottom (isolate 0.122, no thermals): 82.55,8.89 119.38,8.89 119.38,0 82.55,0
ACT_LED  (via drill 0.3)
  Top 0.254: v63,35.28 63.51,34.77 U1.27
  Bottom 0.254: X9.11 99.06,30.34 99.06,35.56 97.79,36.83 87.63,36.83 86.77,37.69 82.58,37.69 80.9,39.37 66.04,39.37 63,36.33 v63,35.28
AT_PARK_PIN  (via drill 0.3 pad 0.25)
  Top 0.254: v40.64,40.64 40.04,40.64 39.81,40.42 39.81,39.76 IC5.P$11
  Bottom 0.254: 44.45,36.83 v40.64,40.64
  Bottom 0.305: 44.45,36.83 44.45,21.03 52.78,12.7 52.78,11.06 U$1.A5
AT_PARK_PIN_EXT
  Top 0.254: R20.1 44.32,30.92 43.02,32.23 40.07,32.23 39.15,33.15 IC5.P$9 39.15,34.92 39.78,35.56 41.91,35.56 45.18,38.83 45.18,44.58 55.88,55.28 55.88,60.96 57.15,62.23 62.23,62.23 63.5,63.5 66.45,63.5 X7.2
AT_PARK_PIN_LOOP  (via drill 0.3 pad 0.25)
  Top 0.254: v29.21,19.05 45.72,19.05 50.16,14.61 50.2,14.57 U$1.A4 | v23.53,19.05 v20.32,19.05 | v15.24,19.05 15.24,19.02 14.99,18.76 IC6.P$5
  Bottom 0.254: v29.21,19.05 v23.53,19.05 | v20.32,19.05 v15.24,19.05
AT_PARK_PIN_LOOP_EXT  (via drill 0.3 pad 0.25)
  Top 0.254: IC6.P$15 8.11,19.41 7.4,20.13 7.4,21.81 6.99,22.23 6.35,22.86 8.38,24.89 8.38,25.02 8.38,26.99 8.45,27.05 v8.45,32.99 | 6.35,22.77 R12.1 | v21.59,68.58 12.7,68.58 11.43,67.31 11.43,61.34 11.84,60.93 11.84,52.9 8.38,49.44 8.38,47.5 10.16,45.72 10.16,43.18 v8.89,41.91 | v26.67,68.58 62.9,68.58 63.79,67.69 X7.3
  Top 0.305: 6.35,22.86 6.35,22.77
  Bottom 0.254: v26.67,68.58 v21.59,68.58 | v8.89,41.91 8.45,41.47 v8.45,32.99
AVDD  (via drill 0.3)
  Top 0.254: 67.33,40.94 C11.1 67.33,40.94 | U1.15 70.33,38.83 71.44,39.94 C12.1 | U1.21 67.33,40.94 | U1.11 74.41,35.27 C17.1
  Top 0.305: C14.1 76.03,31.3 74.61,31.3 74.15,31.77 U1.4 71.14,31.77 71.03,31.78 | 67.33,40.94 C11.1 | U1.21 67.33,36.28 68.1,35.56 | U1.15 70.33,35.62 70.39,35.56 | U1.11 71.15,35.27 71.03,35.27 | U1.8 71.14,33.77 71.03,33.78 | U1.17 69.33,35.57 69.34,35.56
  Top 0.61: 68.1,35.56 69.34,35.56 70.39,35.56 70.74,35.56 arc-90 71.03,35.27 71.03,33.78 71.03,31.78 71.03,30.54 73.63,27.94 76.2,27.94 78.74,25.4 78.74,20.32 80.01,19.05 80.01,14.29 FL1.1 v81.28,13.97 | 90.44,33.08 R25.2 v88.2,33.08 | R23.2 95.76,32.76 v94.5,32.76 | R24.2 v88.2,35.59
  Bottom 0.61: v81.28,13.97 86.36,13.97 88.2,15.75 v88.2,33.08 | v88.2,35.59 v88.2,33.08 | v94.5,32.76 88.52,32.76 v88.2,33.08
BUTTON_EAST_OPEN
  Top 0.254: IC5.P$15 37.24,39.79 37.24,41.94 40.01,44.7 40.01,59.24 U$1.5
BUTTON_EAST_OPEN_5V
  Top 0.254: R16.2 37.97,31.75 36.55,33.18 IC5.P$5 36.54,36.07 37.31,36.83 41.91,36.83 44.45,39.37 44.45,44.45 44.45,44.86 55.12,55.53 55.12,64.51 X4.2
BUTTON_WEST_CLOSE
  Top 0.254: IC5.P$16 36.51,39.77 36.51,43.24 37.47,44.2 37.47,59.24 U$1.6
BUTTON_WEST_CLOSE_5V
  Top 0.254: R15.2 35.9,29.8 IC5.P$4 35.88,33.91 35.88,36.58 37.4,38.1 41.91,38.1 43.18,39.37 43.18,44.45 54.61,55.88 54.61,61.31 50.09,65.83 X4.3
D13  (via drill 0.3 pad 0.25)
  Top 0.254: IC5.P$18 35.24,43.82 35.4,43.97 35.4,50.96 v34.29,52.07
  Bottom 0.254: v34.29,52.07 24.13,52.07 18.16,58.04 18.19,58.07 U$1.13
D13_EXT  (via drill 0.3 pad 0.25)
  Top 0.254: R21.2 31.75,31.75 32.64,32.64 33.78,32.64 34.59,33.45 IC5.P$2 34.58,33.91 v34.58,35.02 | X8.2 3.83,63.48 5.08,62.23 8.89,62.23 9.3,61.85 v9.3,57.21
  Bottom 0.254: v9.3,57.21 15.68,50.8 27.94,50.8 31.75,46.99 31.75,35.56 32,35.31 33.02,35.31 | 33.02,35.31 33.15,35.31 | v34.58,35.02 34.29,35.31 33.02,35.31
DTR_DSR_DCD  (via drill 0.3)
  Top 0.254: IC3.2 103.11,47.47 103.11,47.98 v103.64,48.51 | v107.1,48.51 107.66,47.95 IC3.9 IC3.10
  Bottom 0.254: v103.64,48.51 v107.1,48.51
ETH_CS  (via drill 0.3)
  Top 0.254: U1.32 65.16,32.27 65.22,32.32 65.47,32.58 v65.47,32.83
  Bottom 0.254: U$1.52 82.96,18.64 77.47,24.13 71.12,30.48 68.58,30.48 | 68.58,30.48 68.26,30.48 | v65.47,32.83 67.82,30.48 68.58,30.48
ETH_RESET  (via drill 0.3)
  Top 0.254: v57.15,22.86 58.1,23.81 R30.1 58.83,26.48 60.29,27.94 65.46,27.94 65.83,28.31 U1.37
  Bottom 0.254: U$1.53 85.66,18.64 84.39,17.37 77.06,17.37 76.2,16.51 60.96,16.51 57.15,20.32 v57.15,22.86
FTDI_RESET  (via drill 0.3)
  Top 0.254: v108.05,51.03 108.31,51.29 IC3.19 | R11.1 88.47,56.74 U$1.23
  Bottom 0.254: U$1.23 91.31,56.74 97.02,51.03 v108.05,51.03
GND  (via drill 0.3, 0.3 pad 0.25, 0.6 pad 1.27)
  other vias: 41.91,34.29 26.67,38.1 43.18,48.26 34.29,24.13 26.67,30.48 33.02,48.26 30.86,57.4 27.3,57.4 21.59,43.18 17.78,34.29 101.53,61.41 12.7,50.8 11.43,21.59 101.62,55.89 50.8,16.51 40.64,22.24 68.58,33.02 43.18,54.61 34.96,38.23 72.39,27.34 49.53,55.88 21.59,34.29 3.81,34.29 31.75,34.29 106.69,49.84 11.43,24.13 13.97,12.7 25.94,16.61 6.35,8.89 10.38,15.91 64.77,1.27 68.58,1.27 72.39,1.27 76.2,1.27 2.54,50.8 6.35,55.88 38.1,11.43 37.18,35.05 73.92,33.96 80.23,36 114.3,45.72 102.77,38.71 62.23,17.78 66.04,17.78 69.85,17.78 73.66,17.78 60.96,1.27 57.15,1.27 53.34,1.27 49.53,1.27 45.72,1.27 41.91,1.27 38.1,1.27 34.29,1.27 30.48,1.27 5.08,1.27 1.27,1.27 1.27,5.08 1.27,8.89 11.43,3.81 6.35,3.81 16.51,3.81 21.59,3.81 26.67,3.81 73.66,38.1 91.44,40.95 94.05,30.19 94.19,25.2 80.01,25.4 58.42,27.94 100.33,46.99 76.2,43.18 52.7,31.11 69.69,38.73 65.44,33.72 63.5,44.45 66.04,44.45 64.77,44.45 67.31,44.45 68.58,44.45 69.85,44.45 71.12,44.45 60.96,54.61 59.69,46.99 68.58,46.99 71.12,54.61 76.2,54.61 52.07,46.99 93.02,56.83 91.44,52.07 91.44,48.26 91.44,44.45 71.79,31.15 61.91,32.89
  pour Bottom (isolate 0.122, rank 2, no thermals): 0,0 0,71.12 119.38,71.12 119.38,0
  pour Top (isolate 0.122, rank 2, no thermals): 0,0 0,71.12 119.38,71.12 119.38,0
HOME_SHUTTER_CLOSED  (via drill 0.3 pad 0.25)
  Top 0.254: v46.99,53.34 47.62,53.98 47.62,59.24 U$1.2 | 35.88,39.76 IC5.P$17 35.88,39.76 | v35.88,51.91 35.88,39.76
  Bottom 0.254: v46.99,53.34 37.31,53.34 v35.88,51.91
HOME_SHUTTER_CLOSED_5V  (via drill 0.3 pad 0.25)
  Top 0.254: R18.2 33.81,31.72 35.24,33.15 IC5.P$3 35.21,33.92 35.21,36.8 37.15,38.77 40.96,38.77 41.91,39.75 v41.91,43.18 | v41.31,60.99 41.31,46.35 v41.91,45.72
  Bottom 0.254: v41.91,45.72 v41.91,43.18 | v41.31,60.99 41.31,63.31 X1.2
INT_N
  Top 0.254: U1.36 67.1,30.27 67.31,30.48 67.31,34.67 62.61,39.37 62.23,39.37 60.96,40.64 60.96,44.45 62.23,45.72 79.57,45.72 81.28,44.01 83.19,44.01 U$1.32
LINK_ACK  (via drill 0.3)
  Top 0.254: U1.25 63.77,35.77 62.69,36.85 62.26,36.85 v62.23,36.83
  Bottom 0.254: v62.23,36.83 62.23,38.1 64.77,40.64 81.28,40.64 81.69,40.23 86.45,40.23 87.66,40.23 89.78,38.12 97.14,38.12 99.06,36.2 X9.10
M_DIR  (via drill 0.3 pad 0.25)
  Top 0.254: v22.86,40.64 24.38,42.16 24.38,49.59 23.24,50.74 23.24,59.24 U$1.11 | v19.05,35.56 19.05,28.16 18.38,27.5 18.38,20.1 15.72,17.43 14.4,17.43 IC6.P$3
  Bottom 0.254: v22.86,40.64 19.05,36.83 v19.05,35.56
M_DIR_5V
  Top 0.254: R19.2 6.24,18.11 IC6.P$17 10.3,18.11 12.06,16.35 12.06,8.26 13.97,6.35 13.97,3.83 X6.3
M_EN  (via drill 0.3 pad 0.25)
  Top 0.254: v24.13,40.64 26.67,43.18 26.67,50.8 25.78,51.69 25.78,59.24 U$1.10 | v20.32,35.56 20.32,27.02 20.38,26.96 20.38,20.99 16.22,16.83 14.38,16.83 IC6.P$2
  Bottom 0.254: v24.13,40.64 24.13,39.37 v20.32,35.56
M_EN_5V
  Top 0.254: R14.2 6.7,16.92 7.24,16.92 7.78,17.46 IC6.P$18 10.26,17.46 11.43,16.29 11.43,11.43 3.99,3.99 X6.1
M_STEP  (via drill 0.3 pad 0.25)
  Top 0.254: v19.56,46.1 20.38,46.93 20.38,49.56 20.7,49.88 20.7,59.24 U$1.12 | v16.51,35.56 16.51,27.37 16.38,27.24 16.38,19.24 15.24,18.1 14.39,18.1 IC6.P$4
  Bottom 0.254: v19.56,46.1 19.56,41.15 16.51,38.1 v16.51,35.56
M_STEP_5V
  Top 0.254: R13.1 6.67,19.75 6.86,19.75 7.84,18.77 IC6.P$16 10.45,18.77 12.7,16.51 12.7,11.43 16.51,7.62 22.86,7.62 24.13,6.35 24.13,3.91 X6.5
N$2
  Top 0.813: R8.1 R7.2
N$3
  Top 0.813: R8.2 R10.1
N$5
  Top 0.813: R7.1 41.37,15.65 R2.2
N$6
  Top 0.406: IC3.17 109.61,51.69 110.49,50.8 112.9,50.8 C8.1
N$7  (via drill 0.3)
  Top 0.254: v89.14,24.25 C22.1 | R27.2 v89.14,29.3 | R26.2 v89.14,26.77
  Bottom 0.254: X9.6 107.95,29.2 102.38,23.62 89.78,23.62 v89.14,24.25 v89.14,26.77 v89.14,29.3
N$8
  Top 0.254: R29.1 100.22,37.48 X9.9
N$9
  Bottom 0.254: XB1.16 16.86,46.99 21.59,46.99 23.07,48.47 XB1.12
N$10
  Top 0.406: R28.1 99.58,24.65 100.33,25.4 100.33,26.04 X9.12
N$11
  Top 0.254: C15.2 98.81,28.88 99.22,29.3 99.22,29.93 99.54,30.24 100.17,30.24 100.48,29.93 101.11,29.93 101.43,30.24 101.75,30.55 103,30.55 103.32,30.55 103.64,30.24 103.64,28.66 103.95,28.35 105.19,28.35 X9.7
N$12
  Top 0.254: C21.2 99.25,26.8 99.86,27.41 103.95,27.41 104.58,26.77 107.42,26.77 X9.8
N$13
  Top 0.254: C10.1 R23.1 99.25,33.05 99.54,32.76 104.52,32.76 X9.3
N$22
  Top 0.254: U1.38 66.33,27.66 65.88,27.21 64.04,27.21 62.23,25.4 61.4,25.4 60.96,24.96 R31.1
N$23
  Top 0.254: U1.39 66.83,27.46 66.04,26.67 64.58,26.67 63.06,25.15 R32.1
N$24
  Top 0.254: U1.40 67.33,27.36 65.15,25.18 R33.1
N$25
  Top 0.254: U1.41 67.83,25.73 67.25,25.15 R34.1
N$26
  Top 0.254: U1.42 68.33,26.09 69.34,25.08 R35.1
N$27
  Top 0.254: U1.43 68.83,27.28 71.44,24.67 R36.1
N$28
  Top 0.254: U1.44 69.33,27.38 71.15,25.56 72.96,25.56 73.53,24.99 R37.1
N$29
  Top 0.254: U1.45 69.83,27.52 71.25,26.1 74.45,26.1 75.66,24.89 R38.1
N$31
  Top 0.254: U1.20 67.83,38.46 69.37,40.01 C19.2
N$33
  Top 0.254: U1.22 66.83,38.55 65.25,40.13 C18.2
N$34
  Top 0.254: U1.10 74.56,34.77 R39.1
N$35
  Top 0.254: U1.23 66.33,38.38 65.34,39.37 63.85,39.37 63.18,40.04 R40.2
RESET
  Top 0.406: U$2.1 21.92,11.35 U$1.RESET
RG-11  (via drill 0.3 pad 0.25)
  Top 0.254: IC5.P$13 38.49,40.82 v38.13,41.18 | U$1.7 36.67,57.56 v36.67,44.8
  Bottom 0.254: v38.13,41.18 38.13,43.34 v36.67,44.8
RG-11-IN_5V  (via drill 0.3 pad 0.25)
  Top 0.254: R4.1 40.1,30.39 37.84,32.64 IC5.P$7 37.81,33.92 v37.81,36.07 | R5.1 33.02,52.07 30.48,49.53 30.48,45.72 29.21,44.45 v29.21,40.64 | v29.21,36.83 29.78,36.26 32.89,36.26 v32.92,36.23
  Top 0.813: C1.1 R5.1
  Bottom 0.254: v29.21,40.64 v29.21,36.83 | v32.92,36.23 37.66,36.23 v37.81,36.07
RG-11-IN_EXT
  Top 0.813: R5.2 33.02,60.96 31.75,62.23 20.32,62.23 18.79,63.76 X5.2
RTS_CTS  (via drill 0.3)
  Top 0.254: IC3.3 103.75,47.37 v103.95,47.56 | v108.99,47.25 108.99,45.94 IC3.11
  Bottom 0.254: v103.95,47.56 108.67,47.56 v108.99,47.25
RX2
  Top 0.254: U$1.17 65.44,60.99 65.88,61.44 76.68,61.44 92.6,61.44 96.7,57.33 96.7,54.87 102.44,49.14 102.44,45.92 IC3.1
  Top 0.305: IC3.1
RXN  (via drill 0.3)
  Top 0.254: C21.1 96.02,26.77 R26.1 92.3,25.84 91.98,25.52 87.57,25.52 87.06,25 82.36,25 81.78,25 v81.27,25.52 | U1.5 74.69,32.27 v75.02,31.95
  Bottom 0.254: v75.02,31.95 75.02,31.77 v81.27,25.52
RXP  (via drill 0.3)
  Top 0.254: C15.1 92.72,28.88 R27.1 92.3,28.36 91.98,28.04 88.83,28.04 88.2,28.66 87.57,28.66 86.42,27.52 82.38,27.52 81.86,28.04 v81.27,28.04 | v75.28,32.76 U1.6
  Bottom 0.254: v81.27,28.04 80.01,28.04 v75.28,32.76
SCL
  Top 0.305: IC1.6 4.96,46.99 | 4.96,46.99 4.96,50.68 6.35,52.07 7.62,52.07 8,52.45 8,59.24 U$1.SCL1 | R3.1 1.94,46.99 2.22,47.28 4.67,47.28 4.96,46.99
SCLK
  Top 0.305: U$1.SCK 52.77,36.42 54.07,37.69 63.56,37.69 66.36,34.89 66.36,32.77 65.37,31.78 64.14,31.78 U1.33
SDA
  Top 0.305: R1.1 6.85,46.14 IC1.5 5.65,46.18 5.65,49.53 6.92,50.8 8.89,50.8 10.54,52.45 10.54,59.24 U$1.SDA1
SDI  (via drill 0.3)
  Top 0.305: U1.34 65.85,31.27 v65.88,31.3
  Bottom 0.254: 65.22,31.3 v65.88,31.3 59.5,37.69 53.85,37.69
  Bottom 0.305: U$1.MISO 52.74,38.8 53.85,37.69
SDO  (via drill 0.3)
  Top 0.305: v62.64,30.77 64.13,30.77 U1.35
  Bottom 0.305: U$1.MOSI 56.99,36.42 v62.64,30.77
SHUTTER_OPENED
  Top 0.254: IC5.P$12 39.15,41.37 45.09,47.31 45.09,59.24 U$1.3
SHUTTER_OPENED_5V  (via drill 0.3 pad 0.25)
  Top 0.254: R17.2 42.2,30.89 41.37,31.72 39.81,31.72 38.49,33.04 IC5.P$8 38.48,33.9 v38.48,35.34 | v36.23,60.9 33.59,63.5 31.12,63.5 X3.2 | v38.61,55.88 38.61,44.83 v38.67,44.77
  Bottom 0.254: v36.23,60.9 36.23,58.17 v38.61,55.88 | v38.67,44.77 38.67,43.88 39.37,43.18 39.37,36.23 v38.48,35.34
TX2
  Top 0.254: 92.58,62.23 64.1,62.23 62.9,61.02 U$1.16 | 93.06,62.23 97.65,57.65 97.65,54.81 102.06,50.4 102.85,50.4 105.05,48.2 IC3.5
  Top 0.305: 92.58,62.23 93.06,62.23
TXN
  Top 0.254: X9.2 107.67,34.65 102.38,34.65 101.11,33.39 100.17,33.39 98.91,34.65 94.5,34.65 92.87,33.02 R25.1 92.3,32.13 91.98,31.82 88.2,31.82 86.45,30.07 86.45,30.05 80.77,30.05 79.69,28.98 75.5,28.98 74.23,30.25 72.85,30.25 U1.1
TXP
  Top 0.254: U1.2 74.64,30.77 75.8,29.61 79.69,29.61 82.67,32.59 86.57,32.59 88.31,34.34 91.98,34.34 92.3,34.66 R24.1 92.61,35.28 93.56,35.28 94.19,35.91 94.81,35.91 95.44,35.28 96.08,35.28 96.7,36.23 97.65,36.23 98.59,35.28 99.22,35.28 99.86,35.91 101.11,35.91 102.06,36.85 103,36.85 103.32,36.54 103.32,36.23 103.32,35.91 103.64,35.59 104.81,35.59 X9.1
USBDM
  Top 0.406: X13.2 109.59,55 110.27,54.32 IC3.16
USBDP
  Top 0.406: X13.3 111.59,54.98 110.9,54.29 IC3.15
VCC  (via drill 0.3, 0.3 pad 0.25, 0.3 pad 0.81, 0.4 pad 0.81)  (1 unrouted)
  Top 0.254: v16.92,14.38 15.14,16.16 IC6.P$1
  Top 0.406: IC3.20 107.66,54.91 107.19,55.37 C7.1 105.63,57.54 v105.53,57.65
  Top 0.61: C6.1 | C6.1 4.67,14.29 4.13,14.82 R14.1 R19.1 R13.2 R12.2 | v10,14.38 8.61,14.38 C6.1 | 8.89,3.71 8.89,2.54 10.48,0.95 19.05,0.95 28.38,0.95 29.03,1.6 X6.6 29.03,7.8 27.3,9.53 27.34,9.56 U$1.5V 27.3,11.05 | X6.4 19.02,0.98 | 31.69,27.94 R21.1
  Top 0.813: 8.89,3.71 X6.2 | 19.02,0.98 19.05,0.95 | C6.1 | R21.1 R18.1 R15.1 R16.1 R4.2 R17.1 R20.2 | 27.3,11.05 v27.3,20.95 29.21,22.86 29.21,26.67 30.48,27.94 31.69,27.94
  Bottom 0.406: U$1.5V. U$1.5V.. 103.89,59.28 v105.53,57.65
  Bottom 0.61: v27.3,20.95 23.5,20.95 v20.32,17.78 v16.92,14.38 v10,14.38
  pour Top (isolate 0.122, no thermals): 7.75,16.22 9.4,16.22 9.4,13.65 7.75,13.65
VPIN
  Top 0.813: R2.1 41.4,13.53 R6.2 39.97,12.73 39.97,11.08 U$1.A0
XBEE_DIN  (via drill 0.3)
  Top 0.254: v51.69,62.23 v36.83,62.23 | v11.43,41.02 11.43,41.53 12.83,42.93 17.91,42.93 22.38,47.4 22.38,49.59 22,50.01 v22,60.96
  Bottom 0.254: v36.83,62.23 22.86,62.23 v22,60.96 | v11.43,41.02 11.43,26.51 | v51.69,62.23 67.06,62.23 67.94,61.34 67.98,61.31 U$1.18
  Bottom 0.305: 11.43,26.51 XB1.3
XBEE_DOUT  (via drill 0.3)
  Top 0.254: v50.42,63.25 v36.83,63.25 | v9.4,38.1 9.4,40.51 13.21,44.32 17.27,44.32 18.41,45.47 18.41,49.56 19.46,50.58 v19.46,60.99
  Bottom 0.254: v36.83,63.25 20.95,63.25 v19.46,60.99 | v9.4,38.1 9.4,26.48 XB1.2 | v50.42,63.25 69.47,63.25 70.48,62.23 70.52,62.2 U$1.19
XBEE_RESET  (via drill 0.3)
  Top 0.254: v17.78,36.83 16.51,36.83 15.24,35.56 15.24,26.61 XB1.5 | U$1.8 29.21,57.59 v29.21,48.26
  Bottom 0.254: v29.21,48.26 v17.78,36.83
XI
  Top 0.305: U1.30 62.92,33.27 62.8,33.15 62.8,32.32 62.23,31.75 25MHZ.3

### Text on the board
tPlace: D13 | GND | GND | RG-11 | 12V | Opened | GND | Home | GND | West | East | GND | AT_PARK_PIN_LOOP_EXT | AT_PARK_PIN_EXT | GND | GND | EN | +5V | DIR | +5V | STEP | +5V | +12V
bPlace: D13 | GND | GND | RG-11 | 12V | Opened | GND | Home | GND | West | East | GND | AT_PARK_PIN_EXT | GND | AT_PARK_PIN_LOOP_EXT | EN | +5V | DIR | +5V | STEP | +5V
tDocu: Dome Rotator